# Altium schematic sheet EPS_MPPT_X_EMI-Filter_In.SchDoc: MPPT-X / EMI-Filter / In
size A4
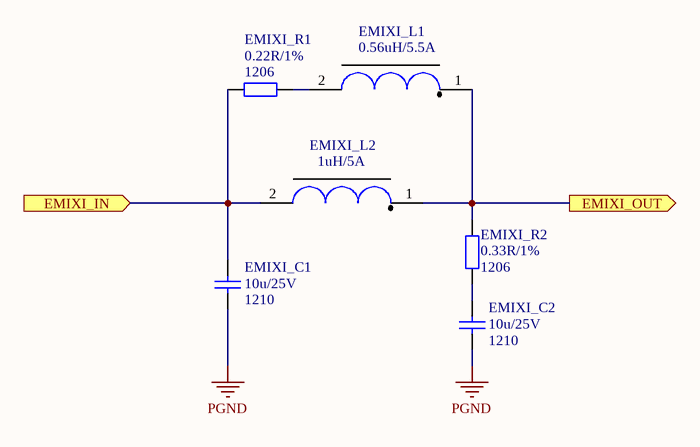
[diagram p0: EPS_MPPT_X_EMI-Filter_In.SchDoc]

## Parts
EMIXI_C1  Package: 1210  [SMD_Capacitor_1210]  (hidden comment: 10u/25V)
EMIXI_C2  Package: 1210  [SMD_Capacitor_1210]  (hidden comment: 10u/25V)
EMIXI_L1  0.56uH/5.5A  [Vishay_IHLP1212]
EMIXI_L2  1uH/5A  [Vishay_IHLP1212]
EMIXI_R1  Package: 1206  [SMD_Resistor_1206]  (hidden comment: 0.22R/1%)
EMIXI_R2  Package: 1206  [SMD_Resistor_1206]  (hidden comment: 0.33R/1%)

## Ports
EMIXI_IN (in), EMIXI_OUT (out)

## Nets
PGND: EMIXI_C1.2 EMIXI_C2.2
EMIXI_IN: EMIXI_C1.1 EMIXI_L2.2 EMIXI_R1.1 ; port EMIXI_IN
EMIXI_OUT: EMIXI_L1.1 EMIXI_L2.1 EMIXI_R2.2 ; port EMIXI_OUT
NetEMIXI_C2_1: EMIXI_C2.1 EMIXI_R2.1
NetEMIXI_L1_2: EMIXI_L1.2 EMIXI_R1.2

## Notes on the sheet
- Title:
- Project:
- Author:
- Model:
- Document Number:
- Checked by:
- Rev:
- Date:
- Approved by:
- Sheet:
- of
- File name:

## Library data of the parts
EMIXI_C1 EMIXI_C2 = Cer_GCJ32ER71E106KA12L: Ceramic Cap Murata Automotive 10u/25V X7R 1210; Manufacturer: Murata; ManufacturerPartNumber: GCJ32ER71E106KA12L; Value: 10u/25V
EMIXI_L1 = IHLP1212BZERR56M11: Vishay IHLP1212 Inductor, L=0.56uH, Irise40deg=5.5A, ESR=16mR, SRF=1MHz.; Manufacturer: Vishay; ManufacturerPartNumber: IHLP1212BZERR56M11; Value: 0.56uH/5.5A
EMIXI_L2 = IHLP1212BZER1R0M11: Vishay IHLP1212 Inductor, L=1uH, Irise40deg=5A, ESR=20mR, SRF=1MHz.; Manufacturer: Vishay; ManufacturerPartNumber: IHLP1212BZER1R0M11; Value: 1uH/5A
EMIXI_R1 = ERJ-8BQFR22V: Panasonic Resistor 0.22R 1% 1206 330mW; Manufacturer: Panasonic; ManufacturerPartNumber: ERJ-8BQFR22V; Value: 0.22R/1%
EMIXI_R2 = ERJ-8BQFR33V: Panasonic Resistor 0.33R 1% 1206 330mW; Manufacturer: Panasonic; ManufacturerPartNumber: ERJ-8BQFR33V; Value: 0.33R/1%